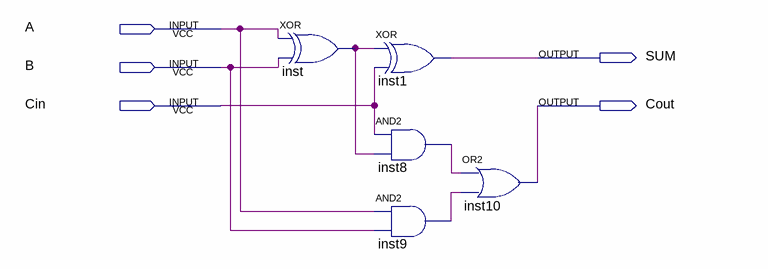
[diagram p0: schematic sheet]
// Quartus schematic full_adder.bdf as structural Verilog: 5 symbols, 5 pins
module full_adder (
  input  A,
  input  B,
  input  Cin,
  output SUM,
  output Cout
);

  wire inst8_out, inst9_out, inst_out;

  xor inst (inst_out, A, B);
  xor inst1 (SUM, inst_out, Cin);
  and inst8 (inst8_out, Cin, inst_out);
  and inst9 (inst9_out, A, B);
  or inst10 (Cout, inst8_out, inst9_out);
endmodule
